# EAGLE schematic V0p2_Main_PCB2 (EAGLE 7.1.0)
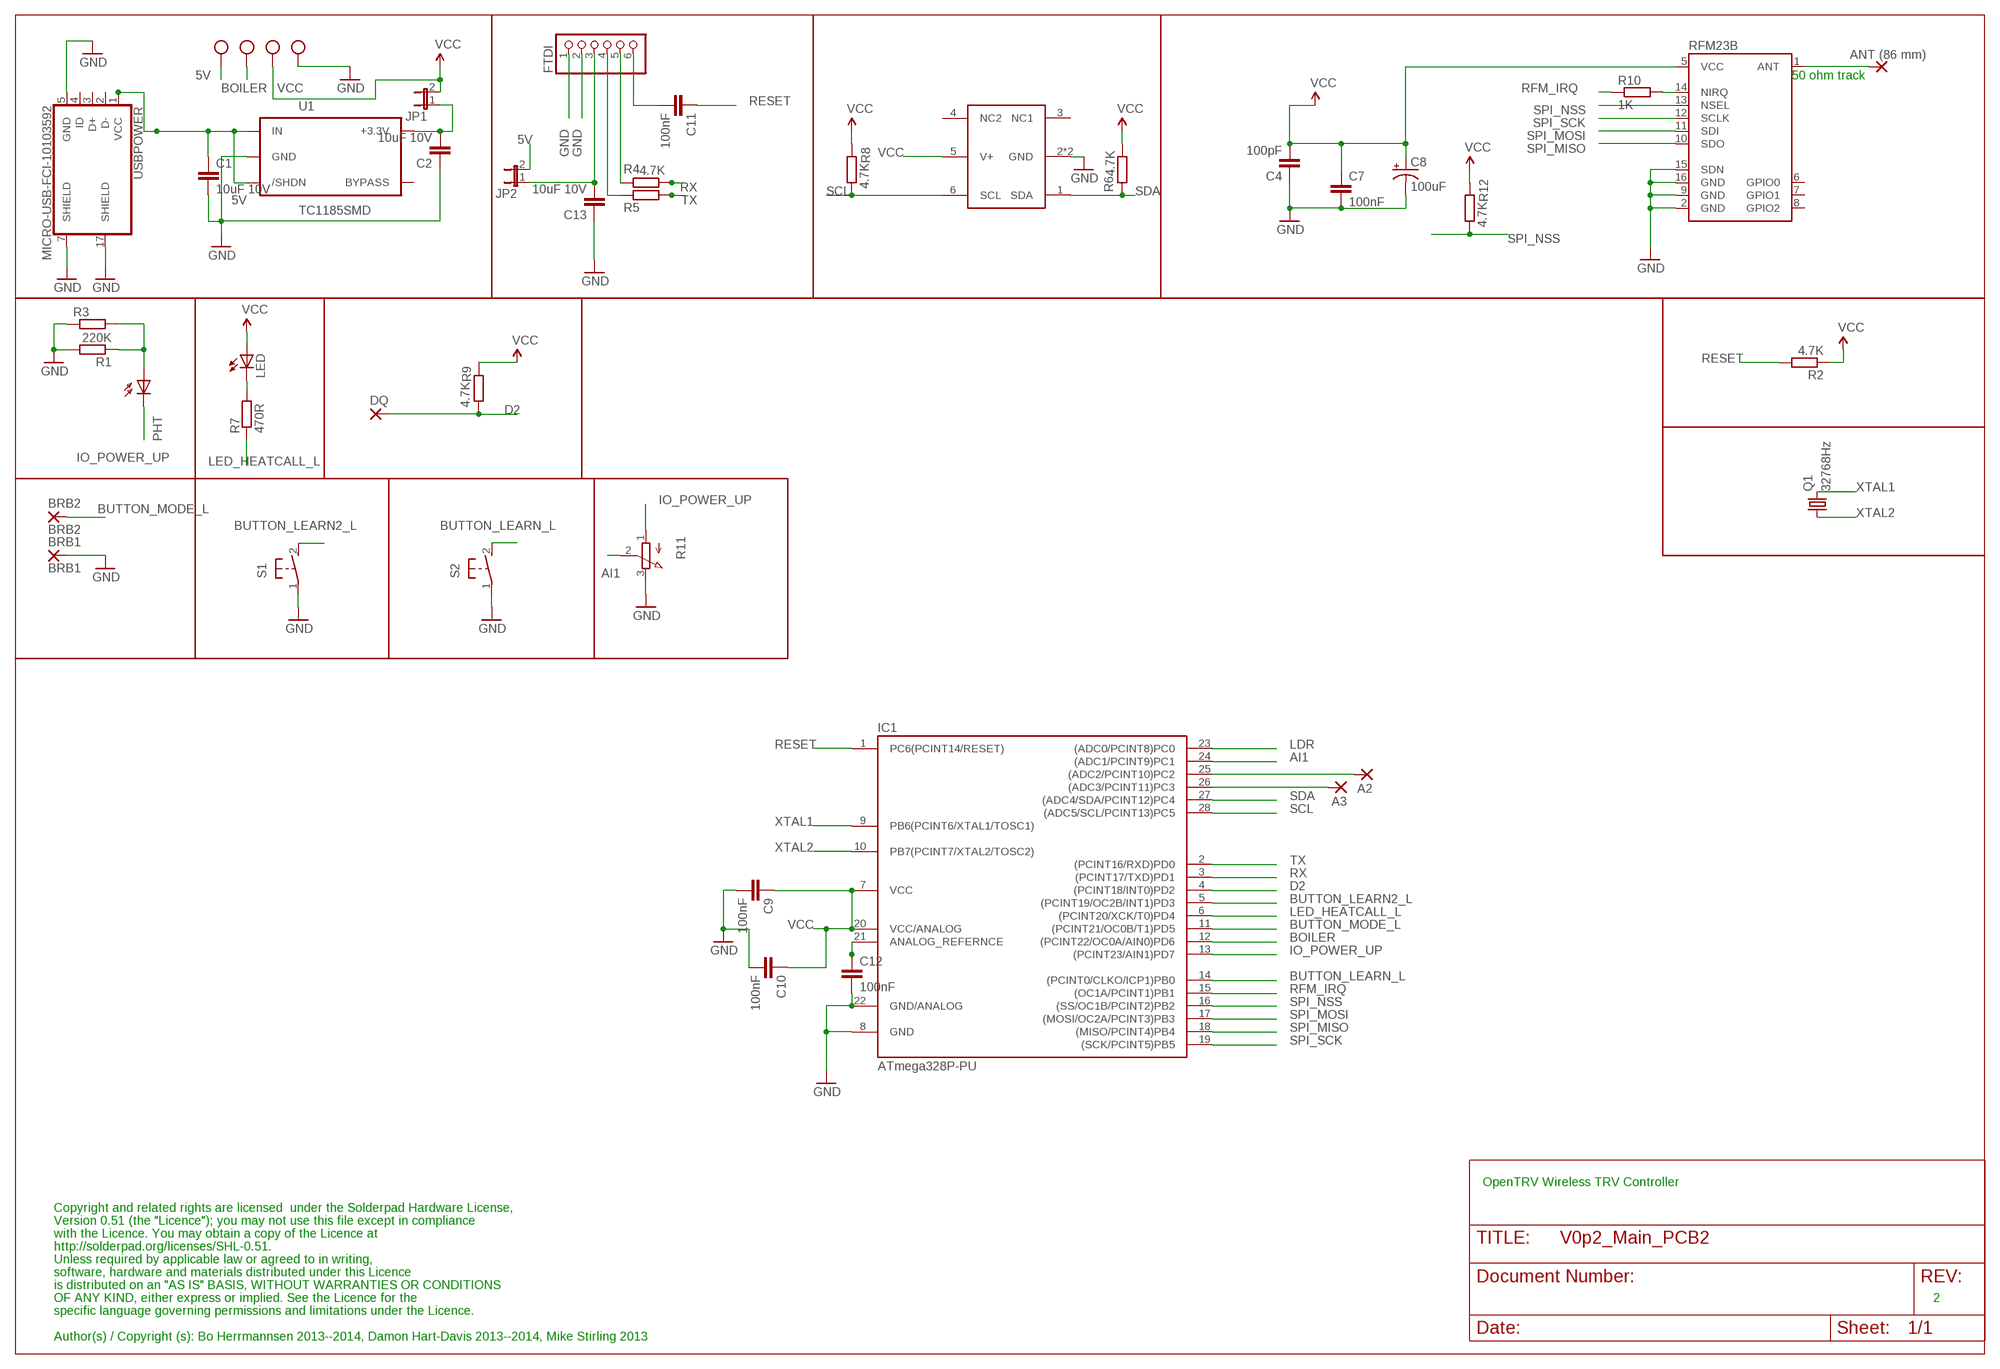
[diagram p0: schematic, sheet 1]

## Parts
A2  2,15/1,0  [2,15/1,0]
A3  2,15/1,0  [2,15/1,0]
ANT1  ANT (86 mm)  2,15/1,0  [2,15/1,0]
BRB1  BRB1  2,15/1,0  [2,15/1,0]
BRB2  BRB2  2,15/1,0  [2,15/1,0]
C1  10uF 10V  C-EUC0603  [C0603]
C2  10uF 10V  C-EUC0603  [C0603]
C4  100pF  C-EUC0603  [C0603]
C7  100nF  C-EUC0603  [C0603]
C8  100uF  CAP_POL1206  [EIA3216]
C9  100nF  C-EUC0603  [C0603]
C10  100nF  C-EUC0603  [C0603]
C11  100nF  C-EUC0603  [C0603]
C12  100nF  C-EUC0603  [C0603]
C13  10uF 10V  C-EUC0603  [C0603]
DQ  2,15/1,0  [2,15/1,0]
FTDI  PINHD-1X6/90  [1X06/90]
IC1  ATmega328P-PU  ATMEGA168-PU  [DIL28-3]
JP1  JP1E  [JP1]
JP2  JP1E  [JP1]
LED  LED3MM  [LED3MM]
PHT  BPX65  [BPX65]
Q1  32768Hz  MC-306  [MC-306]
R1  220K  R-EU_R0603  [R0603]
R2  4.7K  R-EU_R0603  [R0603]
R3  R-EU_0309/V  [0309V]
R4  4.7K  R-EU_R0603  [R0603]
R5  4.7K  R-EU_R0603  [R0603]
R6  4.7K  R-EU_R0603  [R0603]
R7  470R  R-EU_R0603  [R0603]
R8  4.7K  R-EU_R0603  [R0603]
R9  4.7K  R-EU_R0603  [R0603]
R10  1K  R-EU_R0603  [R0603]
R11  EVUE2A  [EVUE]
R12  4.7K  R-EU_R0603  [R0603]
RFM23B  RFM23B  [RFM23-XXX-S1]
S1  31-XX  [B3F-31XX]
S2  31-XX  [B3F-31XX]
U1  TC1185SMD  [TC1185]
U$4  SHT21  [SHT21]
USBPOWER  MICRO-USB-FCI-10103592  [MICRO-USB-FCI-10103592]
X1  W237-102  [SCREWTERMINAL]
X2  W237-102  [SCREWTERMINAL]

## Nets
5V [supply]: C1.1 JP2.2 U1.1(IN) U1.3(/SHDN) USBPOWER.1(VCC) X1.2
AI1: IC1.24((ADC1/PCINT9)PC1) R11.2(S)
BOILER: IC1.12((PCINT22/OC0A/AIN0)PD6) X1.1
BUTTON_LEARN2_L: IC1.5((PCINT19/OC2B/INT1)PD3) S1.2(S)
BUTTON_LEARN_L: IC1.14((PCINT0/CLKO/ICP1)PB0) S2.2(S)
BUTTON_MODE_L: BRB2.1(P) IC1.11((PCINT21/OC0B/T1)PD5)
D2: DQ.1(P) IC1.4((PCINT18/INT0)PD2) R9.1
GND [supply]: BRB1.1(P) C1.2 C2.1 C4.1 C7.2 C8.C(-) C9.2 C10.2 C12.2 C13.1 FTDI.1 FTDI.2 IC1.8(GND) IC1.22(GND/ANALOG) R1.2 R3.1 R11.3(E) RFM23B.2(GND) RFM23B.9(GND) RFM23B.15(SDN) RFM23B.16(GND) S1.1(P) S2.1(P) U1.2(GND) U$4.2(GND) U$4.P$1(GND) USBPOWER.5(GND) USBPOWER.7(SHIELD) USBPOWER.17(SHIELD) X2.2
IO_POWER_UP [supply]: IC1.13((PCINT23/AIN1)PD7) PHT.K(C) R11.1(A)
LDR: IC1.23((ADC0/PCINT8)PC0) PHT.A R1.1 R3.2
LED_HEATCALL_L: IC1.6((PCINT20/XCK/T0)PD4) R7.1
N$1: C11.2 FTDI.6
N$3: FTDI.4 R5.2
N$5: FTDI.5 R4.2
N$6 [supply]: C12.1 IC1.21(ANALOG_REFERNCE)
N$7: R10.2 RFM23B.14(NIRQ)
N$8 [supply]: C2.2 JP1.1 U1.5(+3.3V)
N$11 [supply]: C13.2 FTDI.3 JP2.1
N$13: LED.K(C) R7.2
N$24: A2.1(P) IC1.25((ADC2/PCINT10)PC2)
N$25: A3.1(P) IC1.26((ADC3/PCINT11)PC3)
N$31 [ant]: ANT1.1(P) RFM23B.1(ANT)
RESET: C11.1 IC1.1(PC6(PCINT14/RESET)) R2.2
RFM_IRQ: IC1.15((OC1A/PCINT1)PB1) R10.1
RX: IC1.3((PCINT17/TXD)PD1) R4.1
SCL: IC1.28((ADC5/SCL/PCINT13)PC5) R8.1 U$4.6(SCL)
SDA: IC1.27((ADC4/SDA/PCINT12)PC4) R6.2 U$4.1(SDA)
SPI_MISO: IC1.18((MISO/PCINT4)PB4) RFM23B.10(SDO)
SPI_MOSI: IC1.17((MOSI/OC2A/PCINT3)PB3) RFM23B.11(SDI)
SPI_NSS: IC1.16((SS/OC1B/PCINT2)PB2) R12.1 RFM23B.13(NSEL)
SPI_SCK: IC1.19((SCK/PCINT5)PB5) RFM23B.12(SCLK)
TX: IC1.2((PCINT16/RXD)PD0) R5.1
VCC [supply]: C4.2 C7.1 C8.A(+) C9.1 C10.1 IC1.7(VCC) IC1.20(VCC/ANALOG) JP1.2 LED.A R2.1 R6.1 R8.2 R9.2 R12.2 RFM23B.5(VCC) U$4.5(V+) X2.1
XTAL1: IC1.9(PB6(PCINT6/XTAL1/TOSC1)) Q1.4
XTAL2: IC1.10(PB7(PCINT7/XTAL2/TOSC2)) Q1.1
Unconnected: RFM23B.6(GPIO0) RFM23B.7(GPIO1) RFM23B.8(GPIO2) U1.4(BYPASS) U$4.3(NC1) U$4.4(NC2) USBPOWER.2(D-) USBPOWER.3(D+) USBPOWER.4(ID)

## Notes on the sheet
- 50 ohm track
- OpenTRV Wireless TRV Controller
- Copyright and related rights are licensed  under the Solderpad Hardware License,
- Version 0.51 (the "Licence"); you may not use this file except in compliance
- with the Licence. You may obtain a copy of the Licence at
- http://solderpad.org/licenses/SHL-0.51.
- Unless required by applicable law or agreed to in writing,
- software, hardware and materials distributed under this Licence
- is distributed on an "AS IS" BASIS, WITHOUT WARRANTIES OR CONDITIONS
- OF ANY KIND, either express or implied. See the Licence for the | 2
- specific language governing permissions and limitations under the Licence.
- Author(s) / Copyright (s): Bo Herrmannsen 2013--2014, Damon Hart-Davis 2013--2014, Mike Stirling 2013

## Library data of the parts
A2 A3 ANT1 BRB1 BRB2 DQ = wirepad:2,15/1,0: THROUGH-HOLE PAD
C1 C2 C4 C7 C9-C13 = resistor:C-EU: CAPACITOR, European symbol
C8 = SparkFun-Passives:CAP_POL: Capacitor Polarized These are standard SMD and PTH capacitors. Normally 10uF, 47uF, and 100uF in electrolytic and tantalum varieties. Always verify the external diameter of the through hole cap, it varies with capacity, voltage, and manufacturer. The EIA devices should be standard.
FTDI = pinhead:PINHD-1X6: PIN HEADER
IC1 = Arduino-AVR:ATMEGA168-PU
JP1 JP2 = jumper:JP1E: JUMPER
LED = adafruit:LED: LED OSRAM: - CHIPLED LG R971, LG N971, LY N971, LG Q971, LY Q971, LO R971, LY R971 LH N974, LH R974 LS Q976, LO Q976, LY Q976 LO Q996 - Hyper CHIPLED LW Q18S LB Q993, LB Q99A, LB R99A - SideLED LS A670, LO A670, LY A670, LG A670, LP A670 LB A673, LV A673, LT A673, LW A673 LH A674 LY A675 LS A676, LA A676, LO A676, LY A676, LW A676 LS A679, LY A679, LG A679 - Hyper Micro SIDELED® LS Y876, LA Y876, LO Y876, LY Y876 LT Y87S - SmartLED LW L88C, LW L88S LB L89C, LB L89S, LG L890 LS L89K, LO L89K, LY L89K LS L896, LA L896, LO L896, LY L896 - TOPLED LS T670, LO T670, LY T670, LG T670, LP T670 LSG T670, LSP T670, LSY T670, LOP T670, LYG T670 LG T671, LOG T671, LSG T671 LB T673, LV T673, LT T673, LW T673 LH T674 LS T676, LA T676, LO T676, LY T676, LB T676, LH T676, LSB T676, LW T676 LB T67C, LV T67C, LT T67C, LS T67K, LO T67K, LY T67K, LW E67C LS E67B, LA E67B, LO E67B, LY E67B, LB E67C, LV E67C, LT E67C LW T67C LS T679, LY T679, LG T679 LS T770, LO T770, LY T770, LG T770, LP T770 LB T773, LV T773, LT T773, LW T773 LH T774 LS E675, LA E675, LY E675, LS T675 LS T776, LA T776, LO T776, LY T776, LB T776 LHGB T686 LT T68C, LB T68C - Hyper Mini TOPLED® LB M676 - Mini TOPLED Santana® LG M470 LS M47K, LO M47K, LY M47K Source: http://www.osram.convergy.de/
PHT = opto-trans-siemens:BPX65: PHOTO DIODE; MPN: BPX65.; OC_FARNELL: 327451; OC_NEWARK: 06WX2764
Q1 = crystal:MC-306: kHz RANGE CRYSTAL UNIT SMD Source: MC-306_405_406_E07X.PDF Homepage <http://www.epsontoyocom.co.jp>; MPN: MC-306 60.0KHZ 100PPM ,12.5PF; OC_FARNELL: 1278040; OC_NEWARK: 31M5576
R1-R10 R12 = resistor:R-EU_: RESISTOR, European symbol
R11 = pot:EVU: 9 mm Square Rotary Potentiometers Source: Panasonic
RFM23B = SparkFun-RF:RFM23B
S1 S2 = adafruit:31-XX: OMRON SWITCH Now with beefier pads!
U1 = 3.3VREG:TC1185
U$4 = SHT21:SHT21: Tempsensor RS No: 709-8868 MRF No: TMP112AIDRLT
USBPOWER = micro-usb-fci-10103592:MICRO-USB-FCI-10103592: Micro USB B Connector RS No: 714-2334 MRF No: 10103592-0001LF
X1 X2 = screwterminal:W237-102: Screw terminal 3.5mm Pitch RS No: 710-0444 MRF No:1776275-2; MPN: 237-102; OC_FARNELL: unknown; OC_NEWARK: 70K9898

## Net classes
0 default: width 0.203 mm
1 supply: width 0.5 mm, clearance 0.203 mm
2 ant: width 2.184 mm